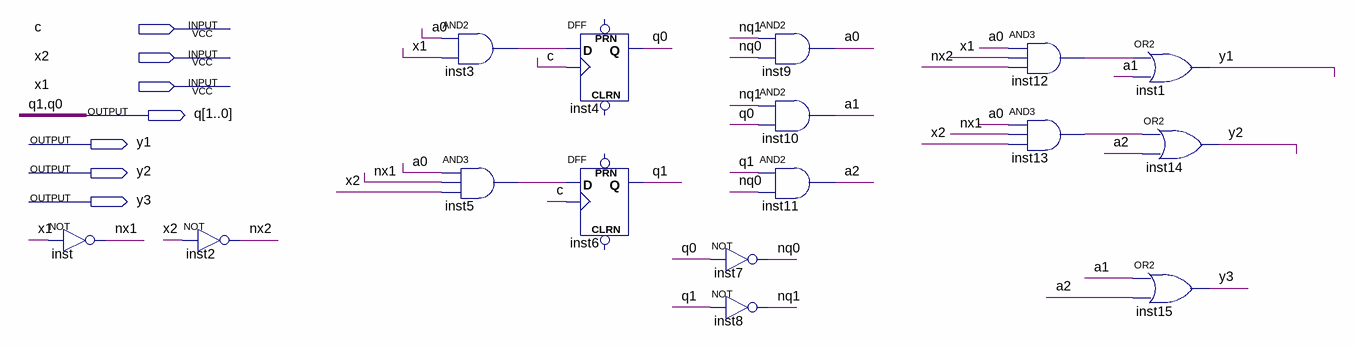
[diagram p0: schematic sheet]
// Quartus schematic s11_mealy.bdf as structural Verilog: 16 symbols, 7 pins
module s11_mealy (
  input  c,
  input  x2,
  input  x1,
  output [1:0] q,
  output y1,
  output y2,
  output y3
);

  wire a0, a1, a2, inst3_out, inst5_out, inst12_out, inst13_out, nq0, nq1, nx1, nx2;

  not inst (nx1, x1);
  not inst2 (nx2, x2);
  and inst3 (inst3_out, a0, x1);
  and inst5 (inst5_out, a0, nx1, x2);
  DFF inst4 (.CLK(c), .D(inst3_out), .Q(q[0]));  // open: CLRN, PRN
  DFF inst6 (.CLK(c), .D(inst5_out), .Q(q[1]));  // open: CLRN, PRN
  and inst9 (a0, nq1, nq0);
  and inst10 (a1, nq1, q[0]);
  and inst11 (a2, q[1], nq0);
  not inst7 (nq0, q[0]);
  not inst8 (nq1, q[1]);
  and inst12 (inst12_out, a0, x1, nx2);
  and inst13 (inst13_out, a0, nx1, x2);
  or inst1 (y1, inst12_out, a1);
  or inst14 (y2, inst13_out, a2);
  or inst15 (y3, a1, a2);
endmodule
